# Altium schematic sheet DC-DC.SchDoc
size A4
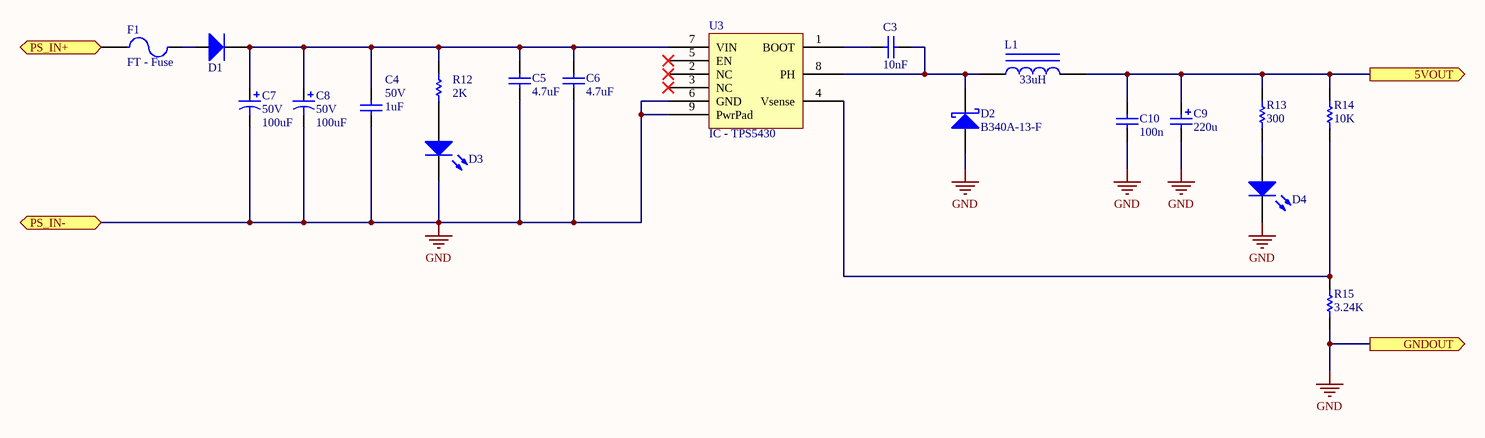
[diagram p0: DC-DC.SchDoc]

## Parts
C3  value 10nF  [CS-0603]  (hidden comment: CS - CAPACITOR)
C4  value 1uF  VOLTAGE: 50V  [CS-0603]  (hidden comment: CS - CAPACITOR)
C5  value 4.7uF  [CS-1206]  (hidden comment: CS - CAPACITOR)
C6  value 4.7uF  [CS-1206]  (hidden comment: CS - CAPACITOR)
C7  value 100uF  VOLTAGE: 50V  [CT-CAP-ALUM-8X14]  (hidden comment: CT - CAPACITOR ELECTROLYTIC)
C8  value 100uF  VOLTAGE: 50V  [CT-CAP-ALUM-8X14]  (hidden comment: CT - CAPACITOR ELECTROLYTIC)
C9  value 220u  [CS-POL-2312]  (hidden comment: CS - CAPACITOR POL)
C10  value 100n  [CS-0603]  (hidden comment: CS - CAPACITOR)
D1  DT - Diode  [IC-TO-220-2-DIODE]  (value not drawn)
D2  B340A-13-F  [DS - DO-214AC-SMA]
D3  LED - NORMAL LED  [LED-0603 YELLOW]  (value not drawn)
D4  LED - NORMAL LED  [LED-0603 YELLOW]  (value not drawn)
F1  FT - Fuse  [FT - 5mm x 20mm]
L1  value 33uH  [LS-Inductor SMD]  (hidden comment: LS - INDUCTOR)
R12  value 2K  [RS-0603]  (hidden comment: RS - RESISTOR)
R13  value 300  [RS-0603]  (hidden comment: RS - RESISTOR)
R14  value 10K  [RS-0603]  (hidden comment: RS - RESISTOR)
R15  value 3.24K  [RS-0603]  (hidden comment: RS - RESISTOR)
U3  IC - TPS5430  [IC-SOIC8-POWERPAD]

## Ports
5VOUT (out), GNDOUT (out), PS_IN+, PS_IN-

## Nets
GND: C4.1 C5.1 C6.1 C7.2 C8.2 C9.2 C10.1 D2.A D3.K D4.K R15.2 U3.6(GND) U3.9(PwrPad) ; port PS_IN-, port GNDOUT
5VOUT: C9.1 C10.2 L1.2 R13.1 R14.1 ; port 5VOUT
PS_IN+: F1.1 ; port PS_IN+
NetC3_1: C3.1 D2.K L1.1 U3.8(PH)
NetC3_2: C3.2 U3.1(BOOT)
NetC4_2: C4.2 C5.2 C6.2 C7.1 C8.1 D1.K R12.2 U3.7(VIN)
NetD1_A: D1.A F1.2
NetD3_A: D3.A R12.1
NetD4_A: D4.A R13.2
NetR14_2: R14.2 R15.1 U3.4(Vsense)

Not connected (* = marked no-connect by the designer): U3 2(NC)* 3(NC)* 5(EN)*

## Library data of the parts
C3 = CS - CAPACITOR: CAP CER 10000PF 50V 10% X7R 0603; Manufacturer: TDK; (FIELD A): Tantalum; VOLTAGE: 16V; Supplier 1: Digikey; Supplier Part Number 1: 445-1311-1-ND; (FLIED C): *; (FIELD B): *; TOLERANCE: 10%
C4 = CS - CAPACITOR: TOLERANCE: 10%; Supplier 1: *; Supplier Part Number 1: *; (FIELD A): *; (FLIED C): *; (FIELD B): *; Manufacturer: *
C5 C6 = CS - CAPACITOR: Manufacturer: Samsung; TOLERANCE: 10%; VOLTAGE: 16V; Supplier 1: Digikey; Supplier Part Number 1: 1276-1292-1-ND; (FIELD A): *; (FLIED C): *; (FIELD B): *
C7 C8 = CT - CAPACITOR ELECTROLYTIC: TOLERANCE: 10%; Supplier 1: *; Supplier Part Number 1: *; (FIELD A): *; (FLIED C): *; (FIELD B): *; Manufacturer: *
C9 = CS - CAPACITOR POL: TOLERANCE: 10%; Supplier 1: *; Supplier Part Number 1: *; (FIELD A): *; (FLIED C): *; (FIELD B): *; Manufacturer: *; VOLTAGE: VOLTAGE; Supplier 2: Digi-Key; Supplier Part Number 2: 478-5236-1-ND
C10 = CS - CAPACITOR: TOLERANCE: 10%; VOLTAGE: 16V; Supplier 1: *; Supplier Part Number 1: 490-1532-1-ND; (FIELD A): *; (FLIED C): *; (FIELD B): *; Manufacturer: *
D1 = DT - Diode: Zener Schottky; Supplier Part Number 1: *; Supplier 1: *; FORWARS VOLTAGE: *; (FIELD A): *; (FIELD B): *; (FIELD C): *; Manufacturer: *; CURRENT MAX: *; Supplier 2: Digi-Key; Supplier Part Number 2: MBR1645-E3/45GI-ND
D2 = DS - Schottky: DIODE SCHOTTKY 40V 3A SMA; Manufacturer: Diodes Incorporated; Supplier Part Number 1: B340A-FDICT-ND; Supplier 1: Digikey; FORWARS VOLTAGE: *; (FIELD A): *; (FIELD B): *; (FIELD C): *; Supplier 2: Digi-Key; Supplier Part Number 2: B340A-FDICT-ND
F1 = FT - Fuse: Manufacturer: Schurter Inc; Supplier 1: Digikey; Supplier Part Number 1: 486-1259-ND
L1 = LS - INDUCTOR: INDUCTOR SHIELD PWR; Manufacturer: Bourns Inc; CURRENT: 2.8A; IMAX: 3A; (FIELD A): *; (FIELD B): *; (FIELD C): *; RESISTOR: *; Supplier 1: Digikey; Supplier Part Number 1: SRR1260-330M
R12 = RS - RESISTOR: TOLERANCE: RES TOL; POWER: 1/10W; Supplier Part Number 1: *; Supplier 1: *; (FIELD A): *; (FLIED C): *; (FIELD B): *; Manufacturer: *
R13-R15 = RS - RESISTOR: TOLERANCE: RES TOL; POWER: RES POWER; Supplier Part Number 1: *; Supplier 1: *; (FIELD A): *; (FLIED C): *; (FIELD B): *; Manufacturer: *
U3 = IC - TPS5430: IC REG BUCK ADJ 3A 8SOPWRPAD; Manufacturer: Texas Instruments; Part Number: TPS5430; Supplier 1: Digi-Key; Supplier Part Number 1: 296-26988-1-ND
D3 D4 = LED - NORMAL LED: FORWARS VOLTAGE: *; CURRENT: *; COLOR: *; Supplier Part Number 1: *; Supplier 1: *; (FIELD B): *; (FIELD A): *; (FIELD C): *; Manufacturer: *